# Altium schematic sheet FeedbackCC1.SchDoc
size A4
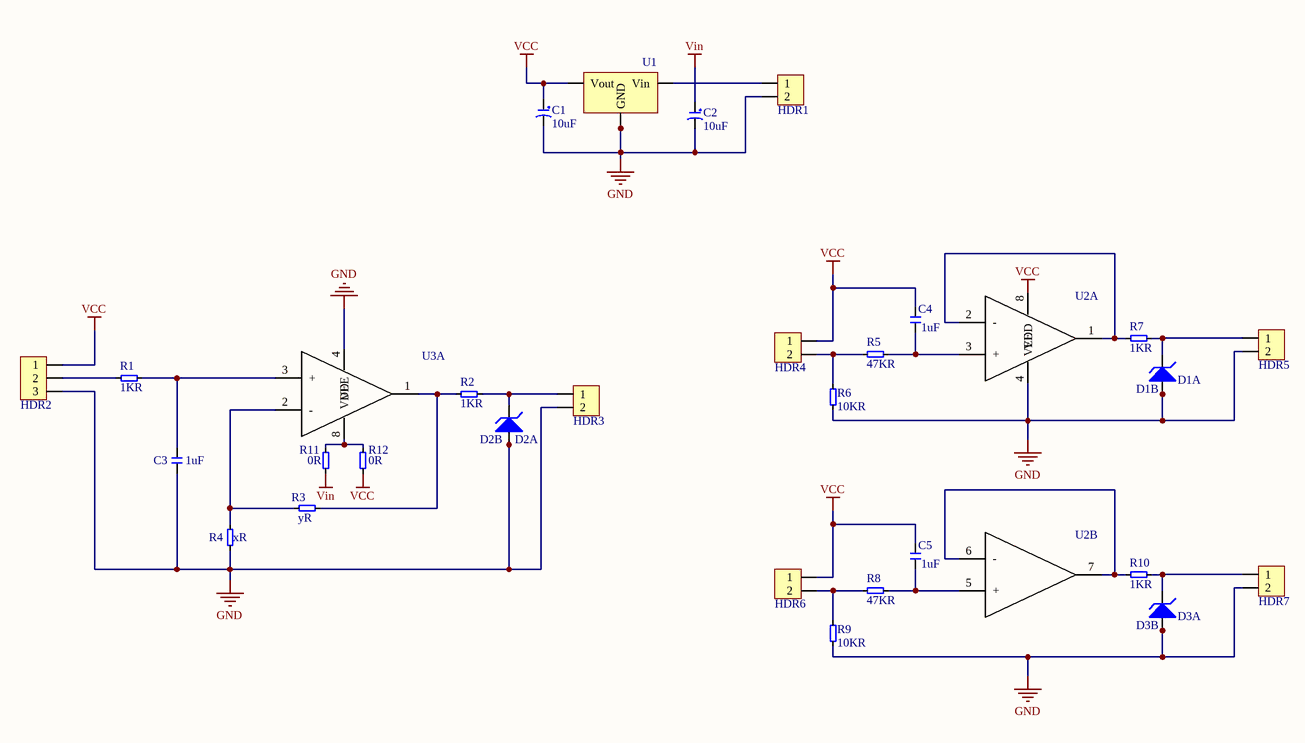
[diagram p0: FeedbackCC1.SchDoc]

## Parts
C1  10uF  [C-TANTALUM-CASE-A]
C2  10uF  [C-TANTALUM-CASE-A]
C3  1uF  [0603]
C4  1uF  [0603]
C5  1uF  [0603]
D1  D. Zener - SOT23-3 2NC  [SOT-23-3]  (value not drawn)  (parts A,B of 2)
D2  D. Zener - SOT23-3 2NC  [SOT-23-3]  (value not drawn)  (parts A,B of 2)
D3  D. Zener - SOT23-3 2NC  [SOT-23-3]  (value not drawn)  (parts A,B of 2)
HDR1  Header 1x2  [HEADER-1X2-KK]  (value not drawn)
HDR2  Header 1x3  [Header-1x3-KK]  (value not drawn)
HDR3  Header 1x2  [HEADER-1X2-KK]  (value not drawn)
HDR4  Header 1x2  [HEADER-1X2-KK]  (value not drawn)
HDR5  Header 1x2  [HEADER-1X2-KK]  (value not drawn)
HDR6  Header 1x2  [HEADER-1X2-KK]  (value not drawn)
HDR7  Header 1x2  [HEADER-1X2-KK]  (value not drawn)
R1  1KR  [0603]
R2  1KR  [0603]
R3  yR  [0603]
R4  xR  [0603]
R5  47KR  [0603]
R6  10KR  [0603]
R7  1KR  [0603]
R8  47KR  [0603]
R9  10KR  [0603]
R10  1KR  [0603]
R11  0R  [0603]
R12  0R  [0603]
U1  VoltReg-5V  [SOT-223]  (value not drawn)
U2  AmpOp-2u  [SOIC-8]  (value not drawn)  (parts A,B of 2)
U3  AmpOp-2u  [SOIC-8]  (value not drawn)  (part A of 2)

## Nets
GND: C1.2 C2.2 C3.2 D1.1 D1.2 D2.1 D2.2 D3.1 D3.2 HDR1.2 HDR2.3 HDR3.2 HDR5.2 HDR7.2 R4.1 R6.1 R9.1 U1.0 U1.1(GND) U2.4(VEE) U3.4(VEE)
VCC: C1.1 C4.1 C5.1 HDR2.1 HDR4.1 HDR6.1 R12.1 U1.2(Vout) U2.8(VDD)
Vin: C2.1 HDR1.1 R11.1 U1.3(Vin)
NetC3_1: C3.1 R1.2 U3.3(+)
NetC4_2: C4.2 R5.2 U2.3(+)
NetC5_2: C5.2 R8.2 U2.5(+)
NetD1_3: D1.3 HDR5.1 R7.2
NetD2_3: D2.3 HDR3.1 R2.2
NetD3_3: D3.3 HDR7.1 R10.2
NetHDR2_2: HDR2.2 R1.1
NetHDR4_2: HDR4.2 R5.1 R6.2
NetHDR6_2: HDR6.2 R8.1 R9.2
NetR2_1: R2.1 R3.2 U3.1(NC)
NetR3_1: R3.1 R4.2 U3.2(-)
NetR7_1: R7.1 U2.1(NC) U2.2(-)
NetR10_1: R10.1 U2.6(-) U2.7(VDD)
NetR11_2: R11.2 R12.2 U3.8(VDD)

## Library data of the parts
C1 C2 = Capacitor-2: Capacitor; Rating: xV; Tolerance: x%; Value: 10uF
C3-C5 = Capacitor-1: Capacitor; Rating: xV; Tolerance: x%; Value: 1uF
D1-D3 = D. Zener - SOT23-3 2NC: Zener Diode SOT23 - 2NC; Part: BZX84C
R1-R12 = Resistor-1: Resistor; Tolerance: 10%
  R1 R2 R7 R10: Value: 1KR
  R3: Value: yR
  R4: Value: xR
  R5 R8: Value: 47KR
  R6 R9: Value: 10KR
  R11 R12: Value: 0R
U1 = VoltReg-5V: CI Voltage Regulator 5V; Part: AMS1117
U2 U3 = AmpOp-2u: AmpOp Single Supply IC Rail-to-Rail with 2 units; Part n: MCP602